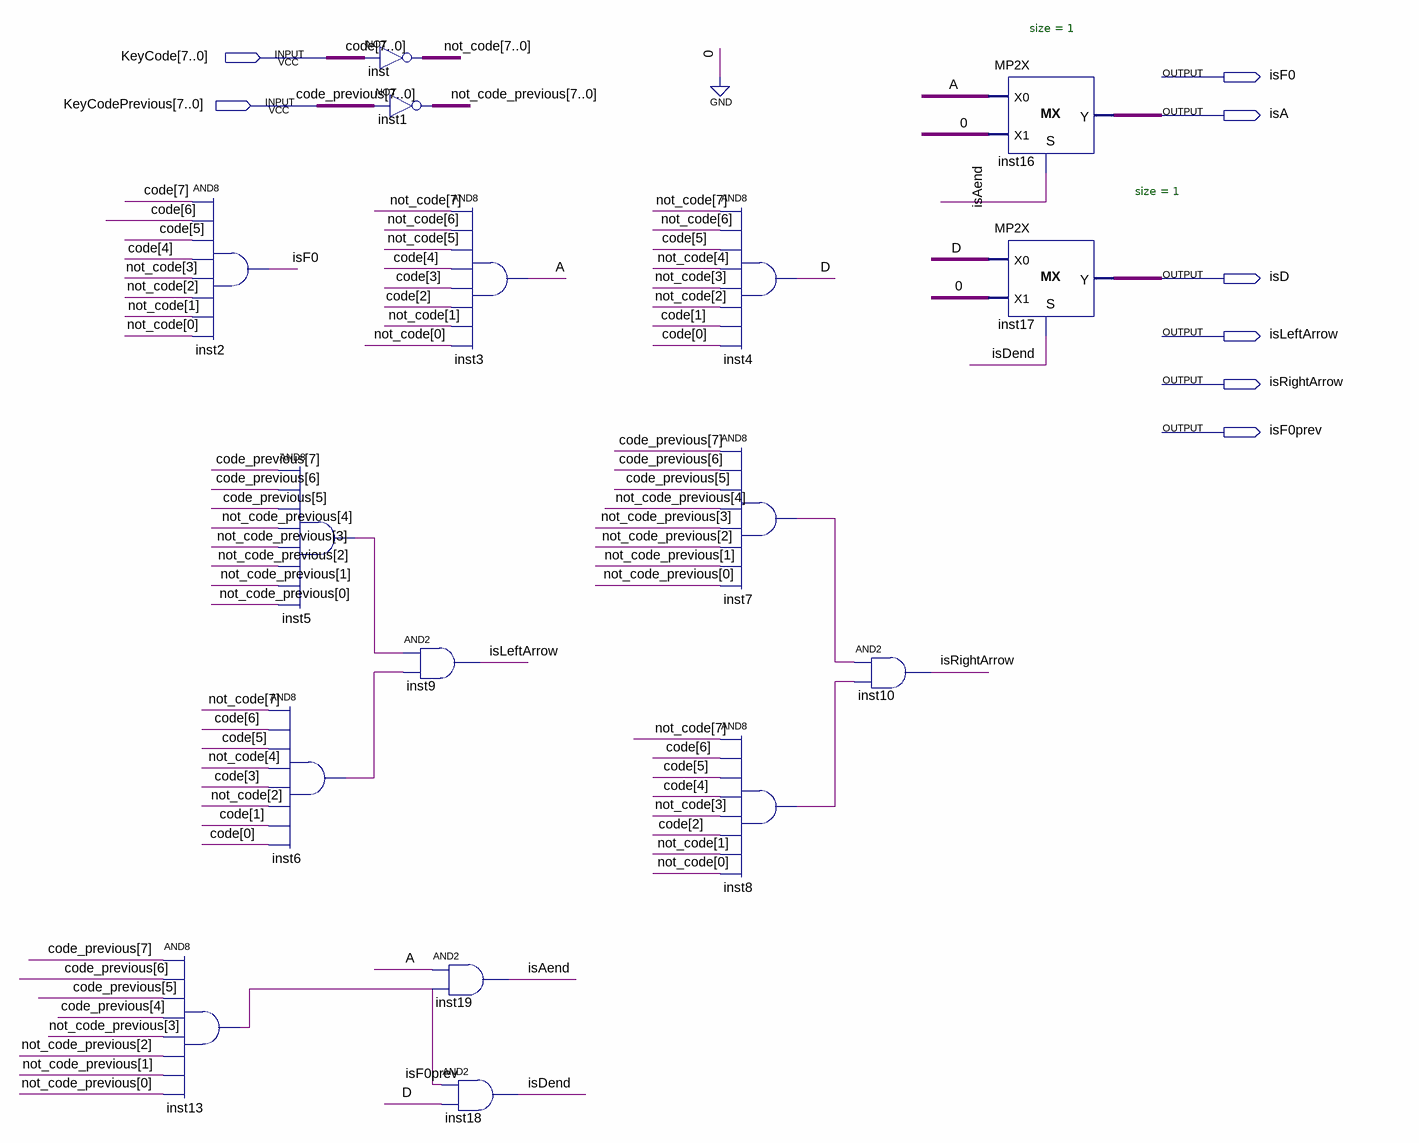
[diagram p0: schematic sheet]
// Quartus schematic KeyDetector.bdf as structural Verilog: 16 symbols, 8 pins
module KeyDetector (
  input  [7:0] KeyCode,
  input  [7:0] KeyCodePrevious,
  output isF0,
  output isA,
  output isD,
  output isLeftArrow,
  output isRightArrow,
  output isF0prev
);

  wire A, D, inst5_out, inst6_out, inst7_out, inst8_out, isAend, isDend;
  wire [7:0] not_code, not_code_previous;

  and inst13 (isF0prev, KeyCodePrevious[7], KeyCodePrevious[6], KeyCodePrevious[5], KeyCodePrevious[4], not_code_previous[3], not_code_previous[2], not_code_previous[1], not_code_previous[0]);
  and inst2 (isF0, KeyCode[7], KeyCode[6], KeyCode[5], KeyCode[4], not_code[3], not_code[2], not_code[1], not_code[0]);
  and inst5 (inst5_out, KeyCodePrevious[7], KeyCodePrevious[6], KeyCodePrevious[5], not_code_previous[4], not_code_previous[3], not_code_previous[2], not_code_previous[1], not_code_previous[0]);
  and inst6 (inst6_out, not_code[7], KeyCode[6], KeyCode[5], not_code[4], KeyCode[3], not_code[2], KeyCode[1], KeyCode[0]);
  assign not_code = ~KeyCode;  // NOT inst, 8 bits wide
  assign not_code_previous = ~KeyCodePrevious;  // NOT inst1, 8 bits wide
  and inst9 (isLeftArrow, inst5_out, inst6_out);
  and inst3 (A, not_code[7], not_code[6], not_code[5], KeyCode[4], KeyCode[3], KeyCode[2], not_code[1], not_code[0]);
  and inst19 (isAend, A, isF0prev);
  and inst18 (isDend, isF0prev, D);
  and inst4 (D, not_code[7], not_code[6], KeyCode[5], not_code[4], not_code[3], not_code[2], KeyCode[1], KeyCode[0]);
  and inst7 (inst7_out, KeyCodePrevious[7], KeyCodePrevious[6], KeyCodePrevious[5], not_code_previous[4], not_code_previous[3], not_code_previous[2], not_code_previous[1], not_code_previous[0]);
  and inst8 (inst8_out, not_code[7], KeyCode[6], KeyCode[5], KeyCode[4], not_code[3], KeyCode[2], not_code[1], not_code[0]);
  and inst10 (isRightArrow, inst7_out, inst8_out);
  MP2X #(.size(1)) inst16 (.S(isAend), .X0(A), .X1(1'b0), .Y(isA));
  MP2X #(.size(1)) inst17 (.S(isDend), .X0(D), .X1(1'b0), .Y(isD));

  // Other names for the same wires on the sheet: code[7:0] = KeyCode; code_previous[7:0] = KeyCodePrevious
endmodule
